# Altium schematic sheet Main.SchDoc
size A; DocumentNumber: 1; SheetNumber: 1; SheetTotal: 5
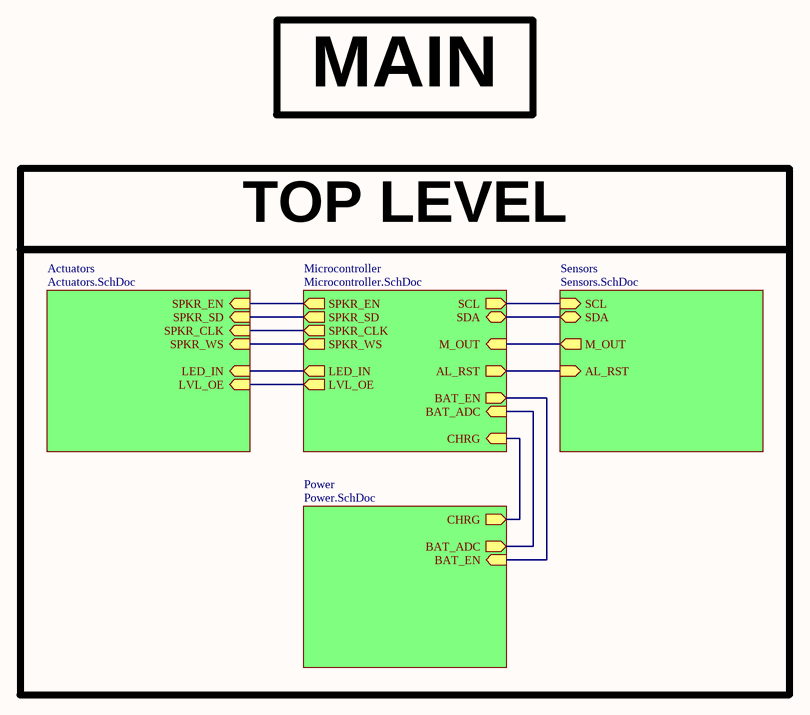
[diagram p0: Main.SchDoc]

## Parts
LOGO  SM Logo  [logo_10]  (value not drawn)  (no BOM)

## Sub-sheets
Actuators = Actuators.SchDoc: SPKR_EN (in), SPKR_SD (in), SPKR_CLK (in), SPKR_WS (in), LED_IN (in), LVL_OE (in)
Microcontroller = Microcontroller.SchDoc: SCL (out), SDA, M_OUT (in), CHRG (in), LVL_OE (out), LED_IN (out), SPKR_EN (out), SPKR_SD (out), SPKR_CLK (out), SPKR_WS (out), AL_RST (out), BAT_ADC (in), BAT_EN (out)
Power = Power.SchDoc: CHRG (out), BAT_ADC (out), BAT_EN (in)
Sensors = Sensors.SchDoc: SCL (in), SDA, AL_RST (in), M_OUT (out)

## Nets
(unnamed): sheet Microcontroller/SCL, sheet Sensors/SCL
(unnamed): sheet Microcontroller/SDA, sheet Sensors/SDA
(unnamed): sheet Microcontroller/M_OUT, sheet Sensors/M_OUT
(unnamed): sheet Microcontroller/CHRG, sheet Power/CHRG
(unnamed): sheet Microcontroller/LVL_OE, sheet Actuators/LVL_OE
(unnamed): sheet Microcontroller/LED_IN, sheet Actuators/LED_IN
(unnamed): sheet Microcontroller/SPKR_EN, sheet Actuators/SPKR_EN
(unnamed): sheet Microcontroller/SPKR_SD, sheet Actuators/SPKR_SD
(unnamed): sheet Microcontroller/SPKR_CLK, sheet Actuators/SPKR_CLK
(unnamed): sheet Microcontroller/SPKR_WS, sheet Actuators/SPKR_WS
(unnamed): sheet Microcontroller/AL_RST, sheet Sensors/AL_RST
(unnamed): sheet Microcontroller/BAT_ADC, sheet Power/BAT_ADC
(unnamed): sheet Microcontroller/BAT_EN, sheet Power/BAT_EN

## Notes on the sheet
- MAIN
- TOP LEVEL

## Library data of the parts
LOGO = smLogo